# EAGLE schematic RAM (EAGLE 9.6.2)
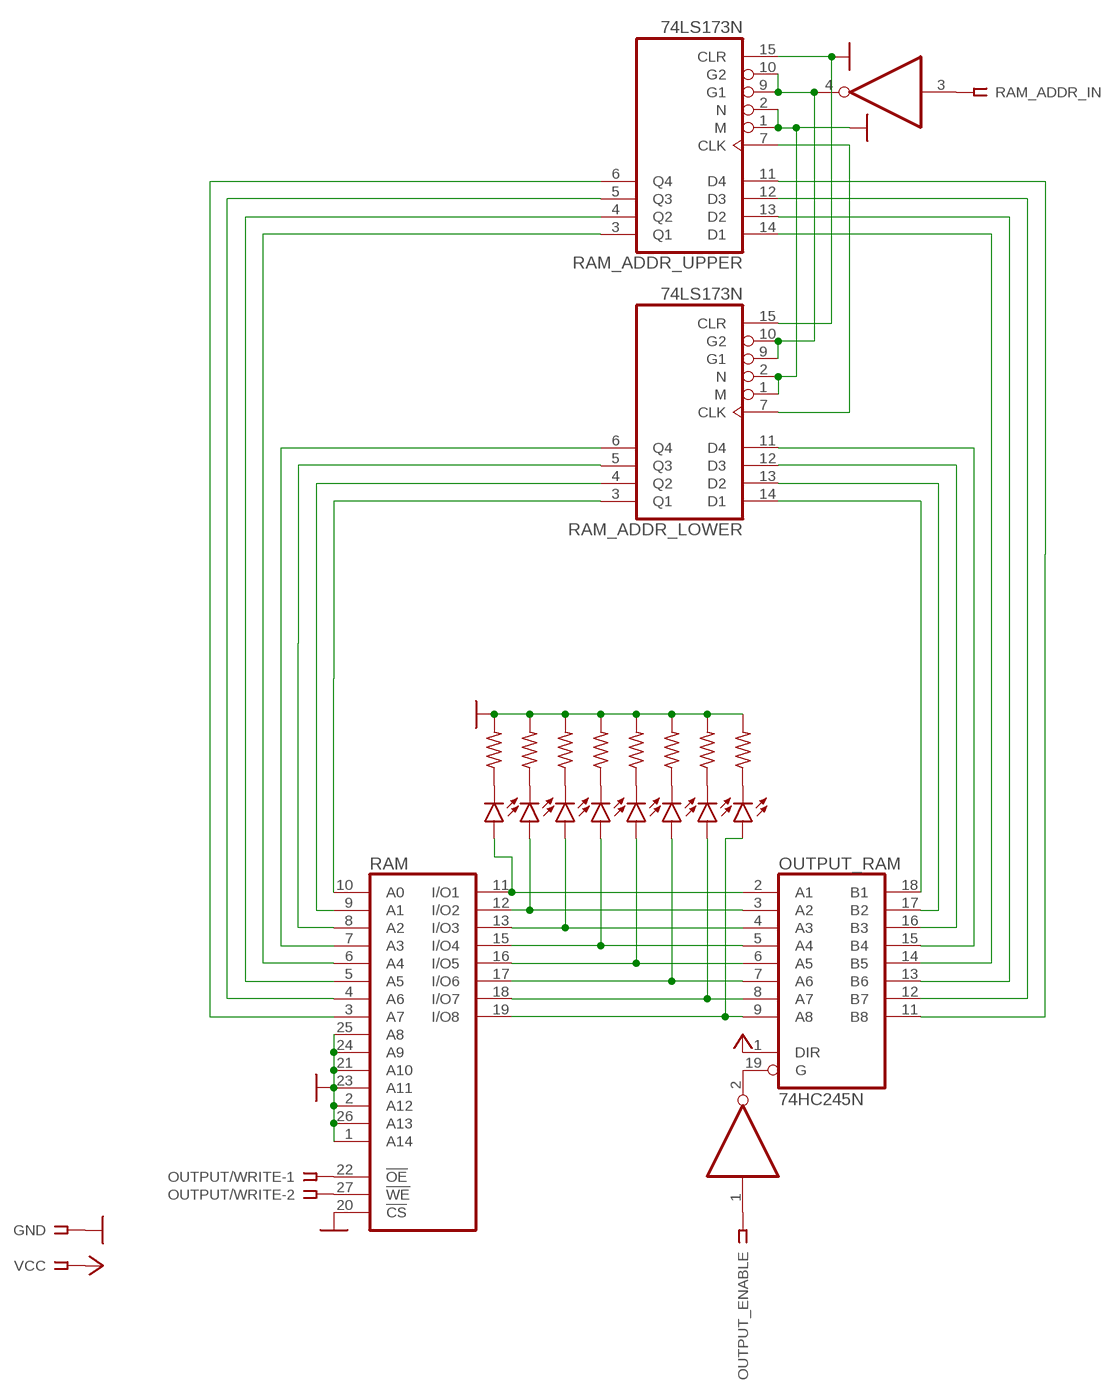
[diagram p0: schematic, sheet 1]

## Parts
GND  SSW-101-02-G-S-RA  [SSW-101-02-G-S-RA]
LED1  LED3MM  [LED3MM]
LED2  LED3MM  [LED3MM]
LED3  LED3MM  [LED3MM]
LED4  LED3MM  [LED3MM]
LED5  LED3MM  [LED3MM]
LED6  LED3MM  [LED3MM]
LED7  LED3MM  [LED3MM]
LED8  LED3MM  [LED3MM]
NOT_GATE  74LS04N  [DIL14]
OUTPUT/WRITE  SSW-102-02-G-S  [SSW-102-02-G-S]
OUTPUT_ENABLE  SSW-101-02-G-S  [SSW-101-02-G-S]
OUTPUT_RAM  74HC245N  [DIL20]
R1  R-US_0204/7  [0204/7]
R2  R-US_0204/7  [0204/7]
R3  R-US_0204/7  [0204/7]
R4  R-US_0204/7  [0204/7]
R5  R-US_0204/7  [0204/7]
R6  R-US_0204/7  [0204/7]
R7  R-US_0204/7  [0204/7]
R8  R-US_0204/7  [0204/7]
RAM  71256P  [DIL28-6]
RAM_ADDR_IN  SSW-101-02-G-S  [SSW-101-02-G-S]
RAM_ADDR_LOWER  74LS173N  [DIL16]
RAM_ADDR_UPPER  74LS173N  [DIL16]
VCC  SSW-101-02-G-S-RA  [SSW-101-02-G-S-RA]

## Nets
GND: GND.1 R1.2 R2.2 R3.2 R4.2 R5.2 R6.2 R7.2 R8.2 RAM.1(A14) RAM.2(A12) RAM.20(!CS) RAM.21(A10) RAM.23(A11) RAM.24(A9) RAM.25(A8) RAM.26(A13) RAM_ADDR_LOWER.1(M) RAM_ADDR_LOWER.2(N) RAM_ADDR_LOWER.15(CLR) RAM_ADDR_UPPER.1(M) RAM_ADDR_UPPER.2(N) RAM_ADDR_UPPER.15(CLR)
N$1: LED8.A OUTPUT_RAM.2(A1) RAM.11(I/O1)
N$2: LED1.A OUTPUT_RAM.3(A2) RAM.12(I/O2)
N$3: LED2.A OUTPUT_RAM.4(A3) RAM.13(I/O3)
N$4: LED3.A OUTPUT_RAM.5(A4) RAM.15(I/O4)
N$5: LED4.A OUTPUT_RAM.6(A5) RAM.16(I/O5)
N$6: LED5.A OUTPUT_RAM.7(A6) RAM.17(I/O6)
N$7: LED6.A OUTPUT_RAM.8(A7) RAM.18(I/O7)
N$8: LED7.A OUTPUT_RAM.9(A8) RAM.19(I/O8)
N$9: LED1.K(C) R1.1
N$10: LED2.K(C) R2.1
N$11: LED3.K(C) R3.1
N$12: LED4.K(C) R4.1
N$13: LED5.K(C) R5.1
N$14: LED6.K(C) R6.1
N$15: LED7.K(C) R7.1
N$16: LED8.K(C) R8.1
N$17: OUTPUT_RAM.18(B1) RAM_ADDR_LOWER.14(D1)
N$18: OUTPUT_RAM.17(B2) RAM_ADDR_LOWER.13(D2)
N$19: OUTPUT_RAM.16(B3) RAM_ADDR_LOWER.12(D3)
N$20: OUTPUT_RAM.15(B4) RAM_ADDR_LOWER.11(D4)
N$21: OUTPUT_RAM.14(B5) RAM_ADDR_UPPER.14(D1)
N$22: OUTPUT_RAM.13(B6) RAM_ADDR_UPPER.13(D2)
N$23: OUTPUT_RAM.12(B7) RAM_ADDR_UPPER.12(D3)
N$24: RAM.3(A7) RAM_ADDR_UPPER.6(Q4)
N$25: NOT_GATE.2(A:O) OUTPUT_RAM.19(G)
N$26: OUTPUT/WRITE.1 RAM.22(!OE)
N$27: OUTPUT/WRITE.2 RAM.27(!WE)
N$28: NOT_GATE.1(A:I) OUTPUT_ENABLE.1
N$29: NOT_GATE.3(B:I) RAM_ADDR_IN.1
N$30: NOT_GATE.4(B:O) RAM_ADDR_LOWER.9(G1) RAM_ADDR_LOWER.10(G2) RAM_ADDR_UPPER.9(G1) RAM_ADDR_UPPER.10(G2)
N$31: RAM.10(A0) RAM_ADDR_LOWER.3(Q1)
N$32: RAM.9(A1) RAM_ADDR_LOWER.4(Q2)
N$33: RAM.8(A2) RAM_ADDR_LOWER.5(Q3)
N$34: RAM.7(A3) RAM_ADDR_LOWER.6(Q4)
N$35: RAM.6(A4) RAM_ADDR_UPPER.3(Q1)
N$36: RAM.5(A5) RAM_ADDR_UPPER.4(Q2)
N$37: RAM.4(A6) RAM_ADDR_UPPER.5(Q3)
N$38: OUTPUT_RAM.11(B8) RAM_ADDR_UPPER.11(D4)
N$40: RAM_ADDR_LOWER.7(CLK) RAM_ADDR_UPPER.7(CLK)
VCC: OUTPUT_RAM.1(DIR) VCC.1
Unconnected: NOT_GATE.5(C:I) NOT_GATE.6(C:O) NOT_GATE.8(D:O) NOT_GATE.9(D:I) NOT_GATE.10(E:O) NOT_GATE.11(E:I) NOT_GATE.12(F:O) NOT_GATE.13(F:I)

## Power pins joined to a net without a drawn wire
GND: NOT_GATE.7(P:GND) OUTPUT_RAM.10(GND) RAM.14(GND) RAM_ADDR_LOWER.8(GND) RAM_ADDR_UPPER.8(GND)
VCC: NOT_GATE.14(P:VCC) OUTPUT_RAM.20(VCC) RAM.28(VCC) RAM_ADDR_LOWER.16(VCC) RAM_ADDR_UPPER.16(VCC)

## Library data of the parts
GND VCC = con-samtec:SSW-101-02-G-S: THROUGH-HOLE .025" SQ POST SOCKET Source: Samtec SSW.pdf; MF: Samtec Inc.; MPN: SSW-101-02-G-S-RA; OC_FARNELL: unknown; OC_NEWARK: 11P9337
LED1-LED8 = led:LED: LED OSRAM: - CHIPLED LG R971, LG N971, LY N971, LG Q971, LY Q971, LO R971, LY R971 LH N974, LH R974 LS Q976, LO Q976, LY Q976 LO Q996 - Hyper CHIPLED LW Q18S LB Q993, LB Q99A, LB R99A - SideLED LS A670, LO A670, LY A670, LG A670, LP A670 LB A673, LV A673, LT A673, LW A673 LH A674 LY A675 LS A676, LA A676, LO A676, LY A676, LW A676 LS A679, LY A679, LG A679 - Hyper Micro SIDELED® LS Y876, LA Y876, LO Y876, LY Y876 LT Y87S - SmartLED LW L88C, LW L88S LB L89C, LB L89S, LG L890 LS L89K, LO L89K, LY L89K LS L896, LA L896, LO L896, LY L896 - TOPLED LS T670, LO T670, LY T670, LG T670, LP T670 LSG T670, LSP T670, LSY T670, LOP T670, LYG T670 LG T671, LOG T671, LSG T671 LB T673, LV T673, LT T673, LW T673 LH T674 LS T676, LA T676, LO T676, LY T676, LB T676, LH T676, LSB T676, LW T676 LB T67C, LV T67C, LT T67C, LS T67K, LO T67K, LY T67K, LW E67C LS E67B, LA E67B, LO E67B, LY E67B, LB E67C, LV E67C, LT E67C LW T67C LS T679, LY T679, LG T679 LS T770, LO T770, LY T770, LG T770, LP T770 LB T773, LV T773, LT T773, LW T773 LH T774 LS E675, LA E675, LY E675, LS T675 LS T776, LA T776, LO T776, LY T776, LB T776 LHGB T686 LT T68C, LB T68C - Hyper Mini TOPLED® LB M676 - Mini TOPLED Santana® LG M470 LS M47K, LO M47K, LY M47K Source: http://www.osram.convergy.de LUXEON: - LUMILED® LXK2-PW12-R00, LXK2-PW12-S00, LXK2-PW14-U00, LXK2-PW14-V00 LXK2-PM12-R00, LXK2-PM12-S00, LXK2-PM14-U00 LXK2-PE12-Q00, LXK2-PE12-R00, LXK2-PE12-S00, LXK2-PE14-T00, LXK2-PE14-U00 LXK2-PB12-K00, LXK2-PB12-L00, LXK2-PB12-M00, LXK2-PB14-N00, LXK2-PB14-P00, LXK2-PB14-Q00 LXK2-PR12-L00, LXK2-PR12-M00, LXK2-PR14-Q00, LXK2-PR14-R00 LXK2-PD12-Q00, LXK2-PD12-R00, LXK2-PD12-S00 LXK2-PH12-R00, LXK2-PH12-S00 LXK2-PL12-P00, LXK2-PL12-Q00, LXK2-PL12-R00 Source: www.luxeon.com KINGBRIGHT: KA-3528ASYC Source: www.kingbright.com
NOT_GATE = 74xx-eu:74*04: Hex INVERTER
OUTPUT/WRITE = con-samtec:SSW-102-02-G-S: THROUGH-HOLE .025" SQ POST SOCKET Source: Samtec SSW.pdf; MF: Samtec Inc.; MPN: SSW-102-02-G-S; OC_FARNELL: unknown; OC_NEWARK: 11P9351
OUTPUT_ENABLE RAM_ADDR_IN = con-samtec:SSW-101-02-G-S: THROUGH-HOLE .025" SQ POST SOCKET Source: Samtec SSW.pdf; MF: Samtec Inc.; MPN: SSW-101-02-G-S; OC_FARNELL: unknown; OC_NEWARK: 11P9336
OUTPUT_RAM = 74xx-eu:74*245: Octal BUS TRANSCEIVER, 3-state
R1-R8 = rcl:R-US_: RESISTOR, American symbol; SPICEPREFIX: R
RAM = memory-idt:71256P: MEMORY; OC_FARNELL: unknown; OC_NEWARK: unknown
RAM_ADDR_LOWER RAM_ADDR_UPPER = 74xx-eu:74*173: 4-bit D type REGISTER, 3-state